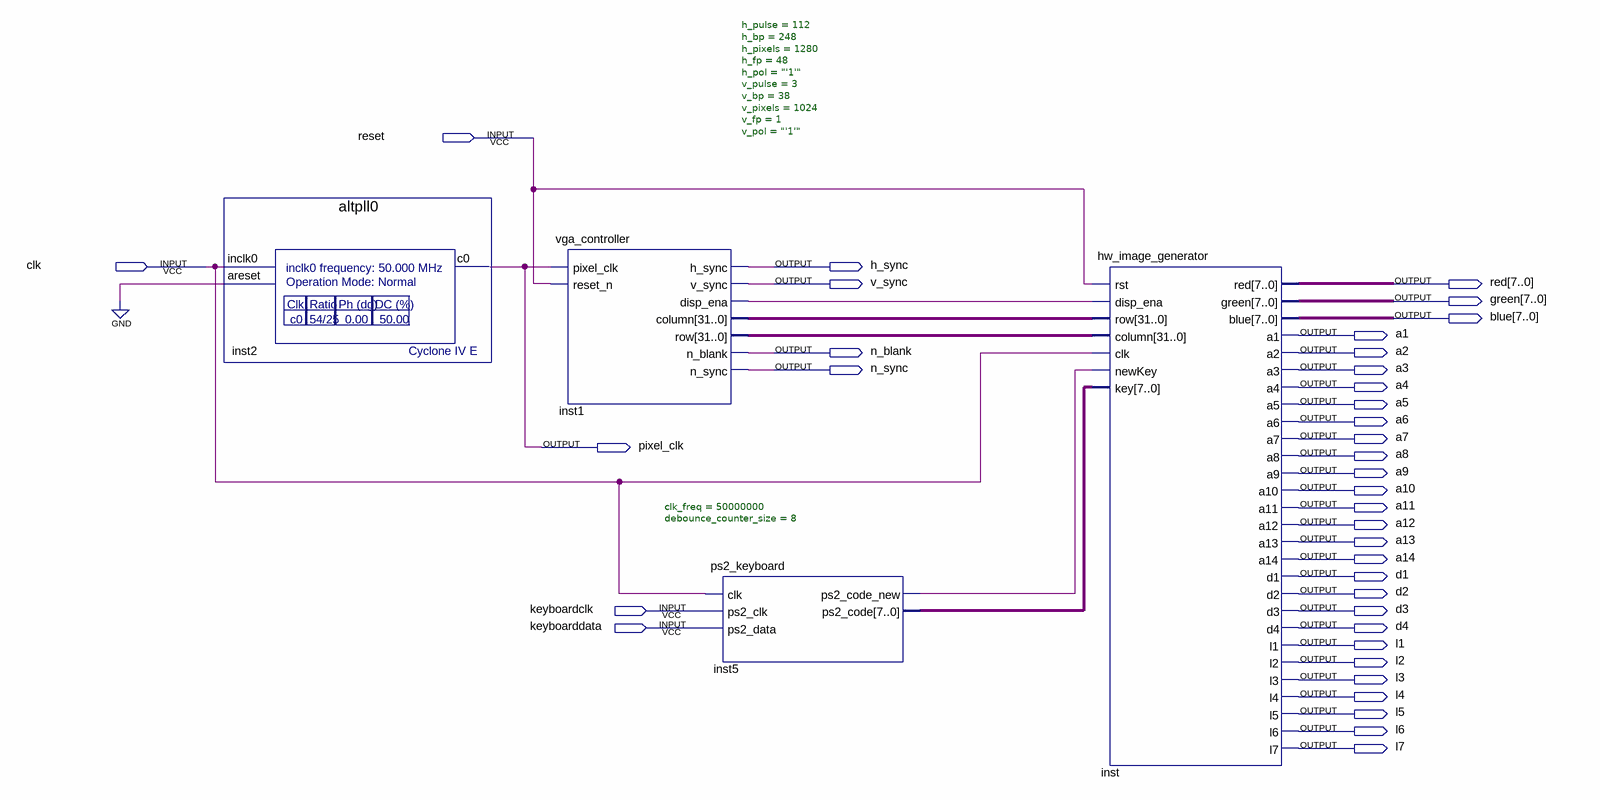
[diagram p0: schematic sheet]
// Quartus schematic vga_with_hw_test_image.bdf as structural Verilog: 4 symbols, 37 pins
module vga_with_hw_test_image (
  input  reset,
  input  clk,
  input  keyboardclk,
  input  keyboarddata,
  output h_sync,
  output v_sync,
  output [7:0] red,
  output [7:0] green,
  output [7:0] blue,
  output a1,
  output n_blank,
  output a2,
  output n_sync,
  output a3,
  output a4,
  output a5,
  output a6,
  output a7,
  output pixel_clk,
  output a8,
  output a9,
  output a10,
  output a11,
  output a12,
  output a13,
  output a14,
  output d1,
  output d2,
  output d3,
  output d4,
  output l1,
  output l2,
  output l3,
  output l4,
  output l5,
  output l6,
  output l7
);

  wire inst1_disp_ena, inst5_ps2_code_new;
  wire [7:0] inst5_ps2_code;
  wire [31:0] inst1_column, inst1_row;

  altpll0 inst2 (.inclk0(clk), .areset(1'b0), .c0(pixel_clk));
  vga_controller #(.h_pulse(112), .h_bp(248), .h_pixels(1280), .h_fp(48), .h_pol("'1'"), .v_pulse(3), .v_bp(38), .v_pixels(1024), .v_fp(1), .v_pol("'1'")) inst1 (
    .pixel_clk(pixel_clk), .reset_n(reset), .h_sync(h_sync), .v_sync(v_sync), .disp_ena(inst1_disp_ena),
    .column(inst1_column), .row(inst1_row), .n_blank(n_blank), .n_sync(n_sync));
  ps2_keyboard #(.clk_freq(50000000), .debounce_counter_size(8)) inst5 (
    .clk(clk), .ps2_clk(keyboardclk), .ps2_data(keyboarddata), .ps2_code_new(inst5_ps2_code_new),
    .ps2_code(inst5_ps2_code));
  hw_image_generator inst (
    .rst(reset), .disp_ena(inst1_disp_ena), .row(inst1_column), .column(inst1_row), .clk(clk),
    .newKey(inst5_ps2_code_new), .key(inst5_ps2_code), .red(red), .green(green), .blue(blue), .a1(a1),
    .a2(a2), .a3(a3), .a4(a4), .a5(a5), .a6(a6), .a7(a7), .a8(a8), .a9(a9), .a10(a10), .a11(a11), .a12(a12),
    .a13(a13), .a14(a14), .d1(d1), .d2(d2), .d3(d3), .d4(d4), .l1(l1), .l2(l2), .l3(l3), .l4(l4), .l5(l5),
    .l6(l6), .l7(l7));
endmodule
